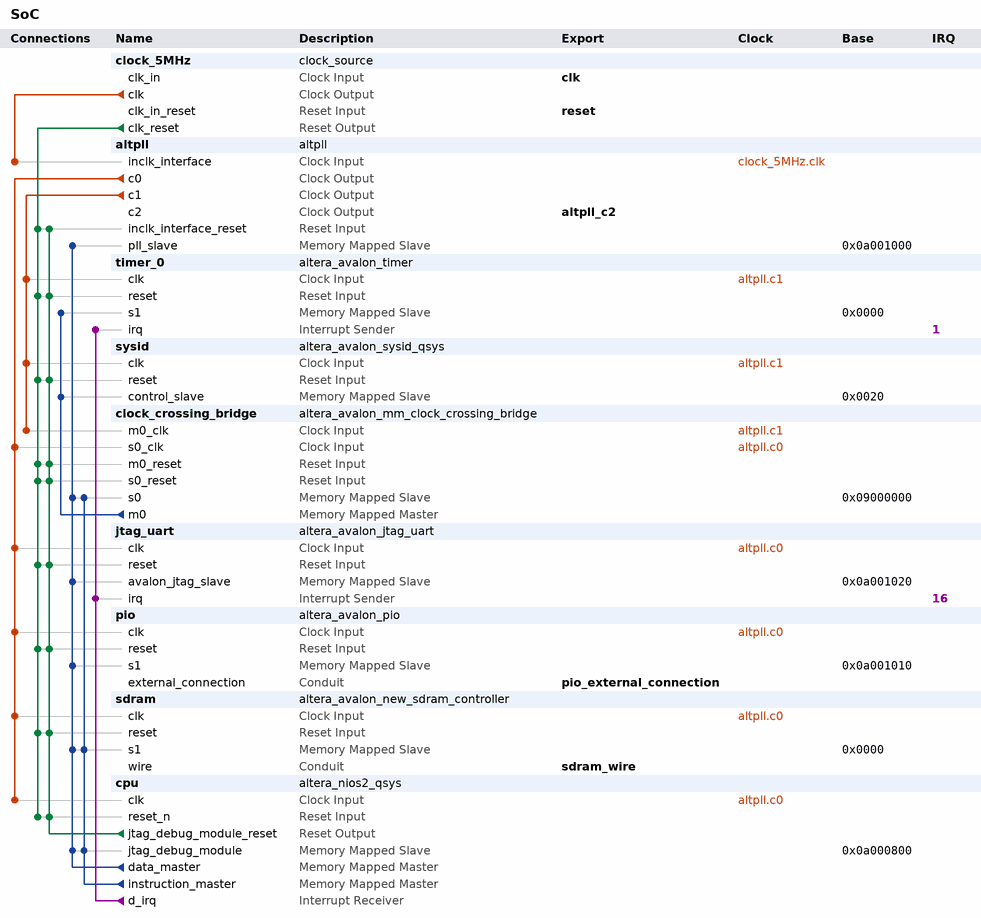
[diagram p0: system contents]
# Platform Designer (Qsys) system SoC, Cyclone IV E EP4CE115F29C7
# Parameters at their usual value, and those the tool derives, are not listed.
package require -exact qsys 12.1
create_system SoC
set_project_property DEVICE_FAMILY {Cyclone IV E}
set_project_property DEVICE EP4CE115F29C7

add_instance clock_5MHz clock_source 12.1
set_instance_parameter_value clock_5MHz clockFrequency 50000000

add_instance altpll altpll 12.1
set_instance_parameter_value altpll INCLK0_INPUT_FREQUENCY 20000
set_instance_parameter_value altpll CLK0_MULTIPLY_BY 2
set_instance_parameter_value altpll CLK1_MULTIPLY_BY 1
set_instance_parameter_value altpll CLK2_MULTIPLY_BY 2
set_instance_parameter_value altpll CLK0_DIVIDE_BY 1
set_instance_parameter_value altpll CLK1_DIVIDE_BY 5
set_instance_parameter_value altpll CLK2_DIVIDE_BY 1
set_instance_parameter_value altpll CLK1_PHASE_SHIFT 0
set_instance_parameter_value altpll CLK2_PHASE_SHIFT -1806
set_instance_parameter_value altpll CLK1_DUTY_CYCLE 50
set_instance_parameter_value altpll CLK2_DUTY_CYCLE 50
set_instance_parameter_value altpll PORT_clk1 PORT_USED
set_instance_parameter_value altpll PORT_clk2 PORT_USED
set_instance_parameter_value altpll PORT_clk3 PORT_UNUSED
set_instance_parameter_value altpll PORT_ARESET PORT_UNUSED
set_instance_parameter_value altpll PORT_LOCKED PORT_UNUSED

add_instance timer_0 altera_avalon_timer 12.1
set_instance_parameter_value timer_0 period 1
set_instance_parameter_value timer_0 periodUnits MSEC
set_instance_parameter_value timer_0 timerPreset CUSTOM

add_instance sysid altera_avalon_sysid_qsys 12.1
set_instance_parameter_value sysid id 0

add_instance clock_crossing_bridge altera_avalon_mm_clock_crossing_bridge 12.1
set_instance_parameter_value clock_crossing_bridge DATA_WIDTH 32
set_instance_parameter_value clock_crossing_bridge ADDRESS_WIDTH 10
set_instance_parameter_value clock_crossing_bridge MAX_BURST_SIZE 1
set_instance_parameter_value clock_crossing_bridge COMMAND_FIFO_DEPTH 4
set_instance_parameter_value clock_crossing_bridge RESPONSE_FIFO_DEPTH 4
set_instance_parameter_value clock_crossing_bridge MASTER_SYNC_DEPTH 2
set_instance_parameter_value clock_crossing_bridge SLAVE_SYNC_DEPTH 2

add_instance jtag_uart altera_avalon_jtag_uart 12.1
set_instance_parameter_value jtag_uart simInteractiveOptions INTERACTIVE_ASCII_OUTPUT

add_instance pio altera_avalon_pio 12.1
set_instance_parameter_value pio direction Output
set_instance_parameter_value pio width 8

add_instance sdram altera_avalon_new_sdram_controller 12.1
set_instance_parameter_value sdram TAC 6.0
set_instance_parameter_value sdram TRCD 20.0
set_instance_parameter_value sdram TRP 20.0
set_instance_parameter_value sdram casLatency 3
set_instance_parameter_value sdram columnWidth 10
set_instance_parameter_value sdram dataWidth 32
set_instance_parameter_value sdram generateSimulationModel false
set_instance_parameter_value sdram model custom
set_instance_parameter_value sdram numberOfBanks 4
set_instance_parameter_value sdram numberOfChipSelects 1
set_instance_parameter_value sdram powerUpDelay 100.0
set_instance_parameter_value sdram refreshPeriod 15.625
set_instance_parameter_value sdram rowWidth 13

add_instance cpu altera_nios2_qsys 12.1
set_instance_parameter_value cpu resetSlave sdram.s1
set_instance_parameter_value cpu exceptionSlave sdram.s1
set_instance_parameter_value cpu breakSlave cpu.jtag_debug_module
set_instance_parameter_value cpu muldiv_multiplierType NoneSmall
set_instance_parameter_value cpu impl Small
set_instance_parameter_value cpu icache_size 4096

# connections
add_connection altpll.c0 clock_crossing_bridge.s0_clk clock
add_connection altpll.c0 cpu.clk clock
add_connection altpll.c0 jtag_uart.clk clock
add_connection altpll.c0 pio.clk clock
add_connection altpll.c0 sdram.clk clock
add_connection altpll.c1 clock_crossing_bridge.m0_clk clock
add_connection altpll.c1 sysid.clk clock
add_connection altpll.c1 timer_0.clk clock
add_connection clock_5MHz.clk altpll.inclk_interface clock
add_connection clock_5MHz.clk_reset altpll.inclk_interface_reset reset
add_connection clock_5MHz.clk_reset clock_crossing_bridge.m0_reset reset
add_connection clock_5MHz.clk_reset clock_crossing_bridge.s0_reset reset
add_connection clock_5MHz.clk_reset cpu.reset_n reset
add_connection clock_5MHz.clk_reset jtag_uart.reset reset
add_connection clock_5MHz.clk_reset pio.reset reset
add_connection clock_5MHz.clk_reset sdram.reset reset
add_connection clock_5MHz.clk_reset sysid.reset reset
add_connection clock_5MHz.clk_reset timer_0.reset reset
add_connection cpu.jtag_debug_module_reset altpll.inclk_interface_reset reset
add_connection cpu.jtag_debug_module_reset clock_crossing_bridge.m0_reset reset
add_connection cpu.jtag_debug_module_reset clock_crossing_bridge.s0_reset reset
add_connection cpu.jtag_debug_module_reset cpu.reset_n reset
add_connection cpu.jtag_debug_module_reset jtag_uart.reset reset
add_connection cpu.jtag_debug_module_reset pio.reset reset
add_connection cpu.jtag_debug_module_reset sdram.reset reset
add_connection cpu.jtag_debug_module_reset sysid.reset reset
add_connection cpu.jtag_debug_module_reset timer_0.reset reset
add_connection clock_crossing_bridge.m0 sysid.control_slave avalon
set_connection_parameter_value clock_crossing_bridge.m0/sysid.control_slave baseAddress 0x0020
add_connection clock_crossing_bridge.m0 timer_0.s1 avalon
set_connection_parameter_value clock_crossing_bridge.m0/timer_0.s1 baseAddress 0x0000
add_connection cpu.data_master altpll.pll_slave avalon
set_connection_parameter_value cpu.data_master/altpll.pll_slave baseAddress 0x0a001000
add_connection cpu.data_master clock_crossing_bridge.s0 avalon
set_connection_parameter_value cpu.data_master/clock_crossing_bridge.s0 baseAddress 0x09000000
add_connection cpu.data_master cpu.jtag_debug_module avalon
set_connection_parameter_value cpu.data_master/cpu.jtag_debug_module baseAddress 0x0a000800
add_connection cpu.data_master jtag_uart.avalon_jtag_slave avalon
set_connection_parameter_value cpu.data_master/jtag_uart.avalon_jtag_slave baseAddress 0x0a001020
add_connection cpu.data_master pio.s1 avalon
set_connection_parameter_value cpu.data_master/pio.s1 baseAddress 0x0a001010
add_connection cpu.data_master sdram.s1 avalon
set_connection_parameter_value cpu.data_master/sdram.s1 baseAddress 0x0000
add_connection cpu.instruction_master clock_crossing_bridge.s0 avalon
set_connection_parameter_value cpu.instruction_master/clock_crossing_bridge.s0 baseAddress 0x09000000
add_connection cpu.instruction_master cpu.jtag_debug_module avalon
set_connection_parameter_value cpu.instruction_master/cpu.jtag_debug_module baseAddress 0x0a000800
add_connection cpu.instruction_master sdram.s1 avalon
set_connection_parameter_value cpu.instruction_master/sdram.s1 baseAddress 0x0000
add_connection cpu.d_irq jtag_uart.irq interrupt
set_connection_parameter_value cpu.d_irq/jtag_uart.irq irqNumber 16
add_connection cpu.d_irq timer_0.irq interrupt
set_connection_parameter_value cpu.d_irq/timer_0.irq irqNumber 1

# exported interfaces
add_interface clk clock sink
set_interface_property clk EXPORT_OF clock_5MHz.clk_in
add_interface reset reset sink
set_interface_property reset EXPORT_OF clock_5MHz.clk_in_reset
add_interface altpll_c2 clock source
set_interface_property altpll_c2 EXPORT_OF altpll.c2
add_interface sdram_wire conduit end
set_interface_property sdram_wire EXPORT_OF sdram.wire
add_interface pio_external_connection conduit end
set_interface_property pio_external_connection EXPORT_OF pio.external_connection

save_system SoC.qsys
